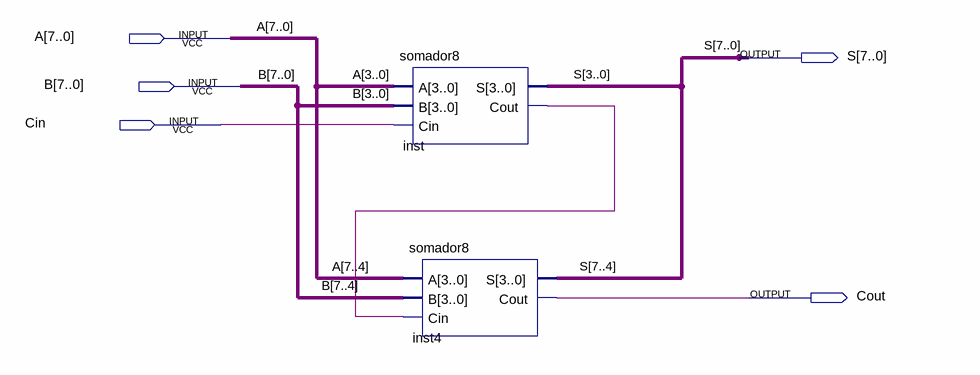
[diagram p0: schematic sheet]
// Quartus schematic somador16.bdf as structural Verilog: 2 symbols, 5 pins
module somador16 (
  input  [7:0] A,
  input  [7:0] B,
  input  Cin,
  output [7:0] S,
  output Cout
);

  wire inst_cout;

  somador8 inst (.A(A[3:0]), .B(B[3:0]), .Cin(Cin), .S(S[3:0]), .Cout(inst_cout));
  somador8 inst4 (.A(A[7:4]), .B(B[7:4]), .Cin(inst_cout), .S(S[7:4]), .Cout(Cout));
endmodule
